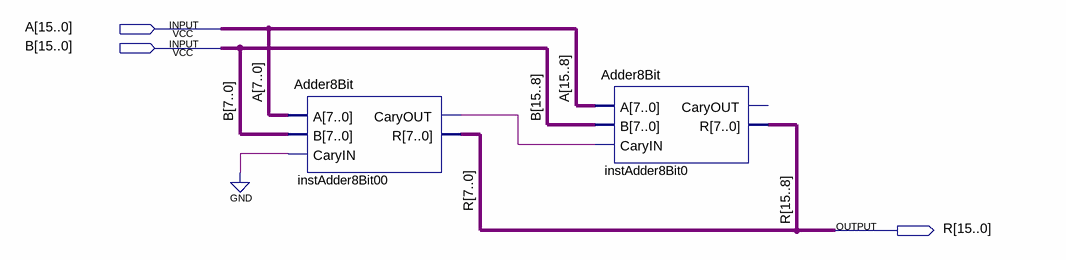
[diagram p0: schematic sheet]
// Quartus schematic Adder16Bit.bdf as structural Verilog: 2 symbols, 3 pins
module Adder16Bit (
  input  [15:0] A,
  input  [15:0] B,
  output [15:0] R
);

  wire instAdder8Bit00_caryout;

  Adder8Bit instAdder8Bit00 (.A(A[7:0]), .B(B[7:0]), .CaryIN(1'b0), .CaryOUT(instAdder8Bit00_caryout), .R(R[7:0]));
  Adder8Bit instAdder8Bit0 (.A(A[15:8]), .B(B[15:8]), .CaryIN(instAdder8Bit00_caryout), .R(R[15:8]));  // open: CaryOUT
endmodule
